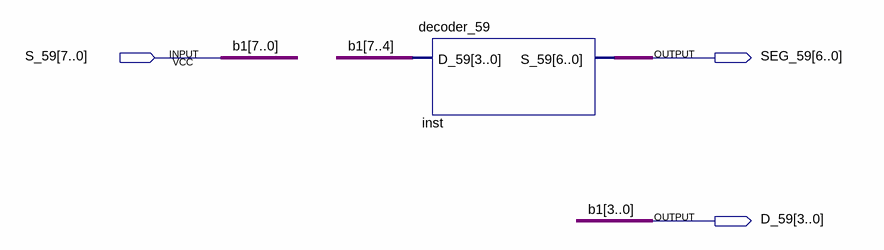
[diagram p0: schematic sheet]
// Quartus schematic static_display_59.bdf as structural Verilog: 1 symbols, 3 pins
module static_display_59 (
  input  [7:0] S_59,
  output [6:0] SEG_59,
  output [3:0] D_59
);

  decoder_59 inst (.D_59(S_59[7:4]), .S_59(SEG_59));

  assign D_59 = S_59[3:0];

  // Other names for the same wires on the sheet: b1[7:0] = S_59
endmodule
